# Altium schematic sheet SD.SchDoc
size 420 x 297 mm; SheetNumber: 4; SheetTotal: 11
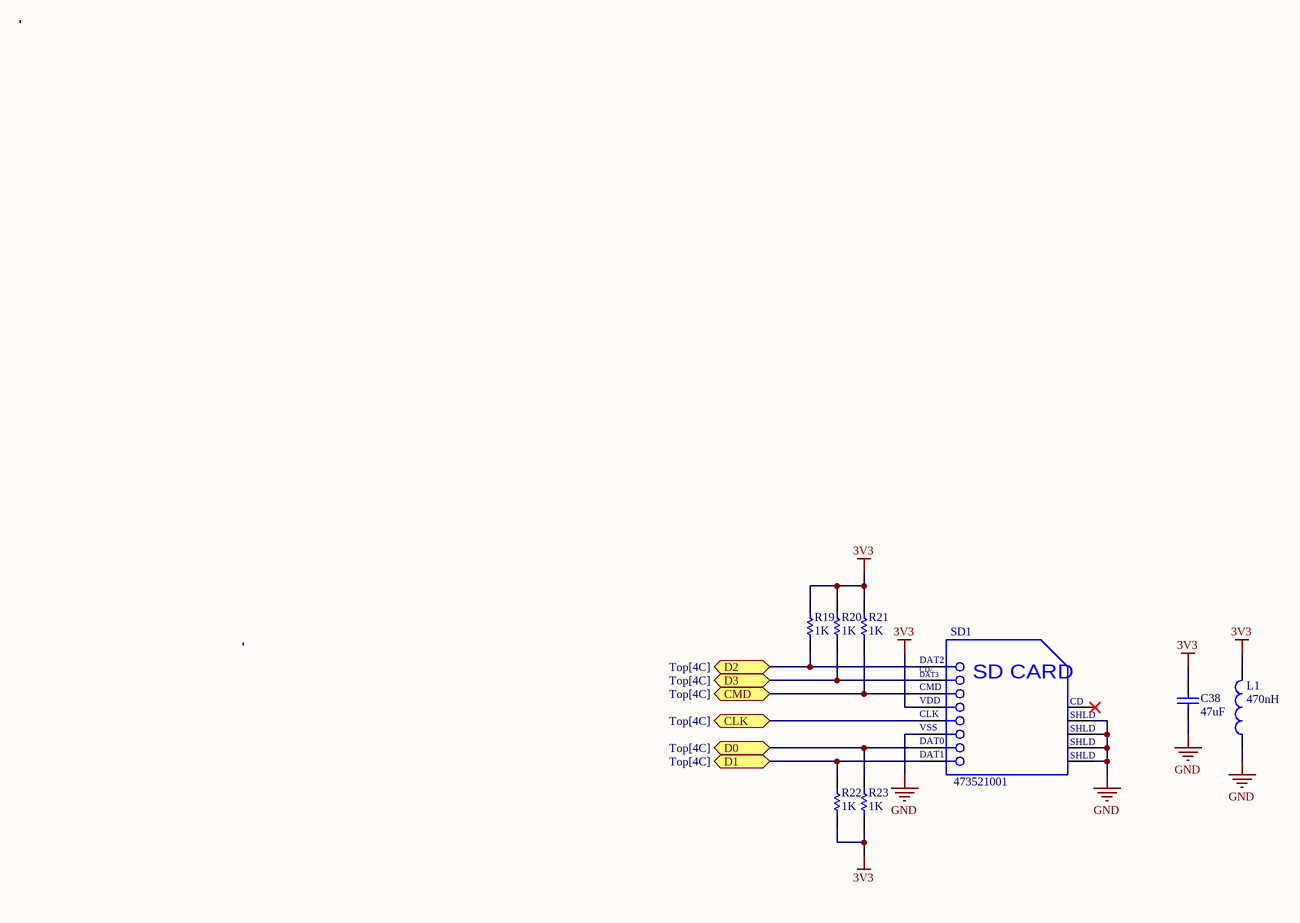
[diagram p0: SD.SchDoc]

## Parts
C38  value 47uF  (hidden comment: Capacitor)
L1  value 470nH  (hidden comment: Inductor)
R19  value 1K  (hidden comment: Resistor)
R20  value 1K  (hidden comment: Resistor)
R21  value 1K  (hidden comment: Resistor)
R22  value 1K  (hidden comment: Resistor)
R23  value 1K  (hidden comment: Resistor)
SD1  473521001  [MOLX-473521001_V]

## Ports
CLK (bidir, see Top[4C]), CMD (bidir, see Top[4C]), D0 (bidir, see Top[4C]), D1 (bidir, see Top[4C]), D2 (bidir, see Top[4C]), D3 (bidir, see Top[4C])

## Nets
3V3: C38.2 L1.2 R19.2 R20.2 R21.2 R22.1 R23.1 SD1.4(VDD)
GND: C38.1 L1.1 SD1.6(VSS) SD1.10(SHLD) SD1.11(SHLD) SD1.12(SHLD) SD1.13(SHLD)
CLK: SD1.5(CLK) ; port CLK
CMD: R21.1 SD1.3(CMD) ; port CMD
D0: R23.2 SD1.7(DAT0) ; port D0
D1: R22.2 SD1.8(DAT1) ; port D1
D2: R19.1 SD1.1(DAT2) ; port D2
D3: R20.1 SD1.2(CD/DAT3) ; port D3

Not connected (* = marked no-connect by the designer): SD1 9(CD)*

## Notes on the sheet
- THIS DOCUMENT AND THE DATA DISCLOSED HEREIN OR
- HEREWITH IS THE PROPERTY OF ALTIUM LIMITED AND MAY
- DWG NO:
- REVISION
- REV:
- DESCRIPTION
- DATE
- APPROVED
- BE FREELY DISTRIBUTED IN WHOLE. NO RIGHTS ARE
- RESERVED OR EXPRESS OR IMPLIED WARANTEE GIVEN.
- ENG:
- APPROVALS
- PROJECT
- DSN:
- CHK:
- REFERENCE DOCUMENTS
- PROJECT REVISION:
- TITLE
- DOCUMENT REVISION:
- DESIGN ITEM:
- BOM:
- FAB DWG:
- PCB DWG:
- ASSY DWG:
- SCALE:
- A3
- SIZE
- CAGE CODE
- FILE NAME
- DWG NO.
- SHEET
- OF
- REV
- (in symbol CMP-2000-05848-1) CD/; DAT3; SD CARD

## Library data of the parts
C38 = Capacitor: SimulationGenericComponent: True
L1 = Inductor: SimulationGenericComponent: True
R19-R23 = Resistor: TC1: 0; SimulationGenericComponent: True; TC2: 0
SD1 = CMP-2000-05848-1: MicroSD(TM), Pitch 1.1 mm, 8 Position, Height 1.88 mm, -20 to 85 degC, RoHS, Tape and Reel; Manufacturer: Molex; Datasheet Version: Rev. G, 01/2012; Datasheet URL: http://www.molex.com/pdm_docs/sd/473521001_sd.pdf; Package Reference: 473521001; Manufacturer URL: http://www.molex.com/; Mounting Technology: SurfaceMount; Package Description: MicroSD(TM), Pitch 1.1 mm, 8 Position, Height 1.88 mm